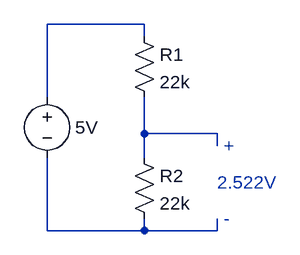
[diagram p0: schematic demo_pre_trim.asc]
demo_pre_trim.asc, the LTspice schematic file:
Version 4
SHEET 1 880 680
WIRE 240 16 112 16
WIRE 240 32 240 16
WIRE 112 112 112 16
WIRE 240 160 240 112
WIRE 336 160 240 160
WIRE 336 176 336 160
WIRE 240 192 240 160
WIRE 112 288 112 192
WIRE 240 288 240 272
WIRE 240 288 112 288
WIRE 336 288 336 272
WIRE 336 288 240 288
SYMBOL voltage 112 96 R0
WINDOW 0 24 16 Invisible 2
WINDOW 3 37 56 Left 2
SYMATTR InstName V1
SYMATTR Value 5V
SYMBOL res 224 176 R0
SYMATTR InstName R2
SYMATTR Value 22k
SYMBOL res 224 16 R0
SYMATTR InstName R1
SYMATTR Value 22k
TEXT 336 224 Left 2 ;2.522V
TEXT 344 176 Left 2 ;+
TEXT 344 272 Left 2 ;-

The netlist it stands for:
* demo_pre_trim.asc
V1 N001 N003 5V
R2 N002 N003 22k
R1 N001 N002 22k
* 2.522V
* +
* -
.backanno
.end